# Altium schematic sheet USB.SchDoc: Bison-Board
size A4; DrawnBy: mzy2364; Revision: V1.4
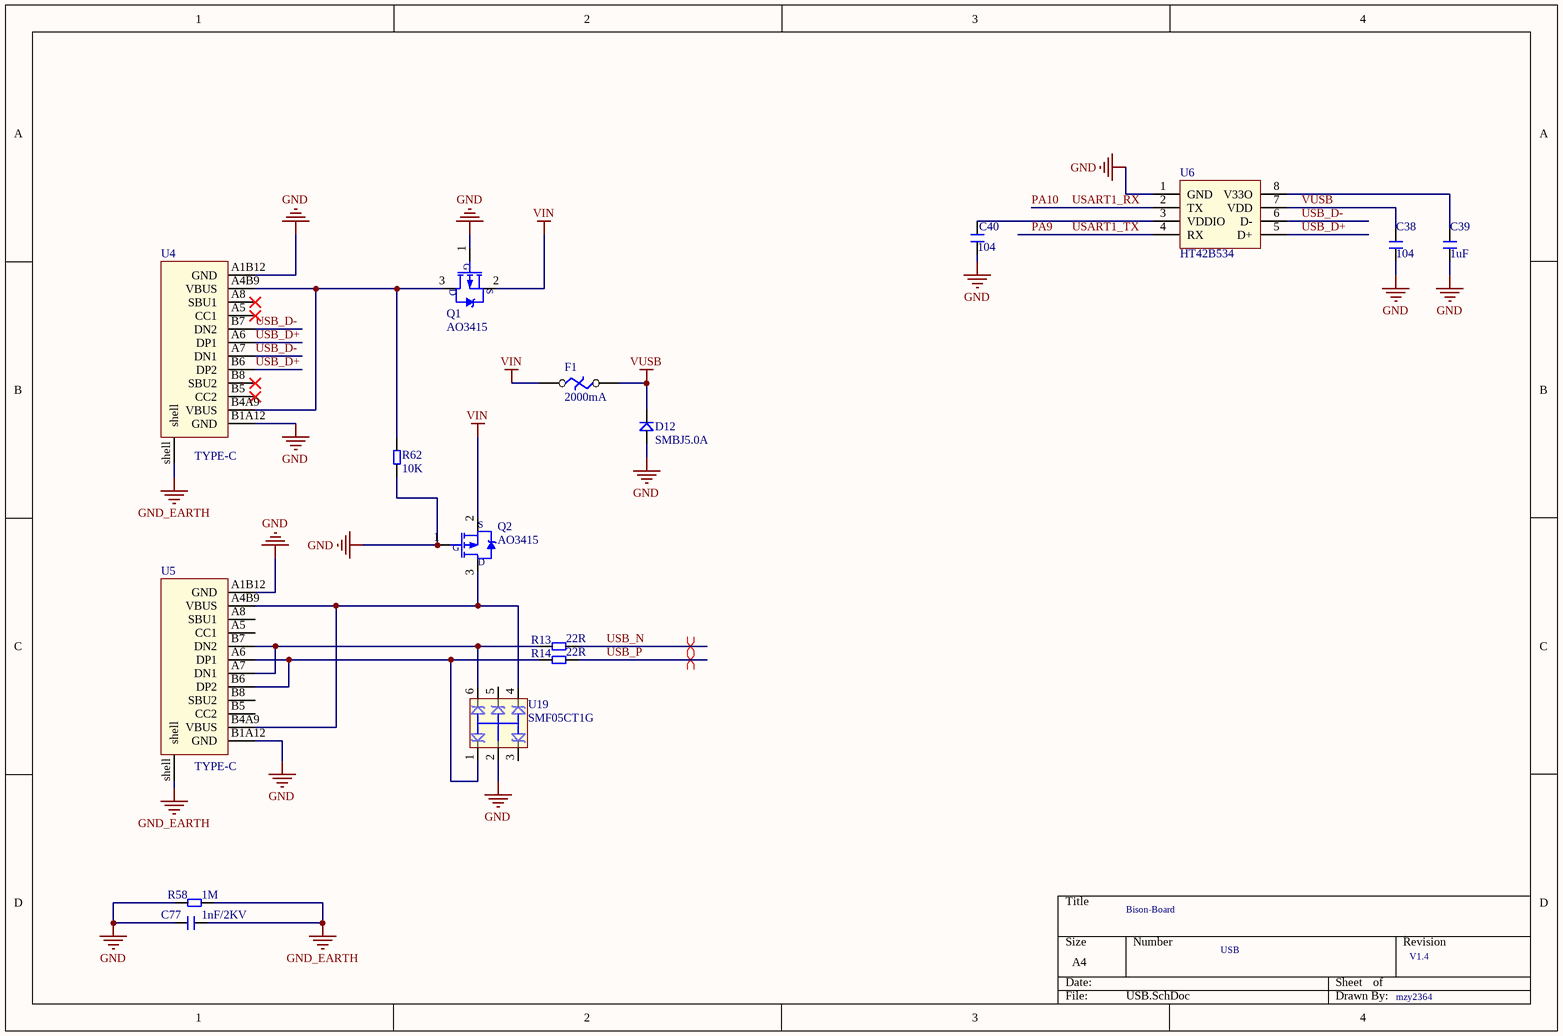
[diagram p0: USB.SchDoc]

## Parts
C38  104  [C 0603]
C39  1uF  [C 0603]
C40  104  [C 0603]
C77  1nF/2KV  [C 1206]
D12  SMBJ5.0A  [SMA]
F1  2000mA  [F 0805]
Q1  AO3415  [SOT23-3]
Q2  AO3415  [SOT23-3]
R13  22R  [R 0603]
R14  22R  [R 0603]
R58  1M  [R 1206]
R62  10K  [R 0603]
U4  TYPE-C  [USB-TYPE-C]
U5  TYPE-C  [USB-TYPE-C]
U6  HT42B534  [SOP8]
U19  SMF05CT1G  [SOT363]

## Nets
GND: C38.1 C39.2 C40.1 C77.1 D12.1 Q1.1(G) Q2.1(G) R58.1 R62.1 U4.A1B12(GND) U4.B1A12(GND) U5.A1B12(GND) U5.B1A12(GND) U6.1(GND) U19.2
GND_EARTH: C77.2 R58.2 U4.shell U5.shell
VIN: F1.1 Q1.2(S) Q2.2(S)
VUSB: C38.2 D12.2 F1.2 U6.7(VDD)
PA9: U6.4(RX)  [also labelled USART1_TX]
PA10: U6.2(TX)  [also labelled USART1_RX]
USB_D+: U4.A6(DP1) U4.B6(DP2) U6.5(D+)
USB_D-: U4.A7(DN1) U4.B7(DN2) U6.6(D-)
USB_N: R13.2
USB_P: R14.2
NetC39_1: C39.1 U6.8(V33O)
NetC40_2: C40.2 U6.3(VDDIO)
NetQ1_3: Q1.3(D) R62.2 U4.A4B9(VBUS) U4.B4A9(VBUS)
NetQ2_3: Q2.3(D) U5.A4B9(VBUS) U5.B4A9(VBUS) U19.4
NetR13_1: R13.1 U5.A7(DN1) U5.B7(DN2) U19.6
NetR14_1: R14.1 U5.A6(DP1) U5.B6(DP2) U19.1

Not connected (* = marked no-connect by the designer): U4 A5(CC1)* A8(SBU1)* B5(CC2)* B8(SBU2)*; U5 A5(CC1) A8(SBU1) B5(CC2) B8(SBU2); U19 3 5

## Layout directives
differential pair: USB_N, USB_P

## Notes on the sheet
- USB

## Library data of the parts
C38-C40 C77 = CAP
D12 = Diode
F1 = F: 熔断开关
Q1 Q2 = PMOS-2
R13 R14 R58 R62 = RES
U4 U5 = USB TYPE-C: TYPE-C 16pin
U6 = HT42B534: USB转串口
U19 = SMF05CT1G: TVS